# Altium schematic sheet anti-phubber.SchDoc
size A4
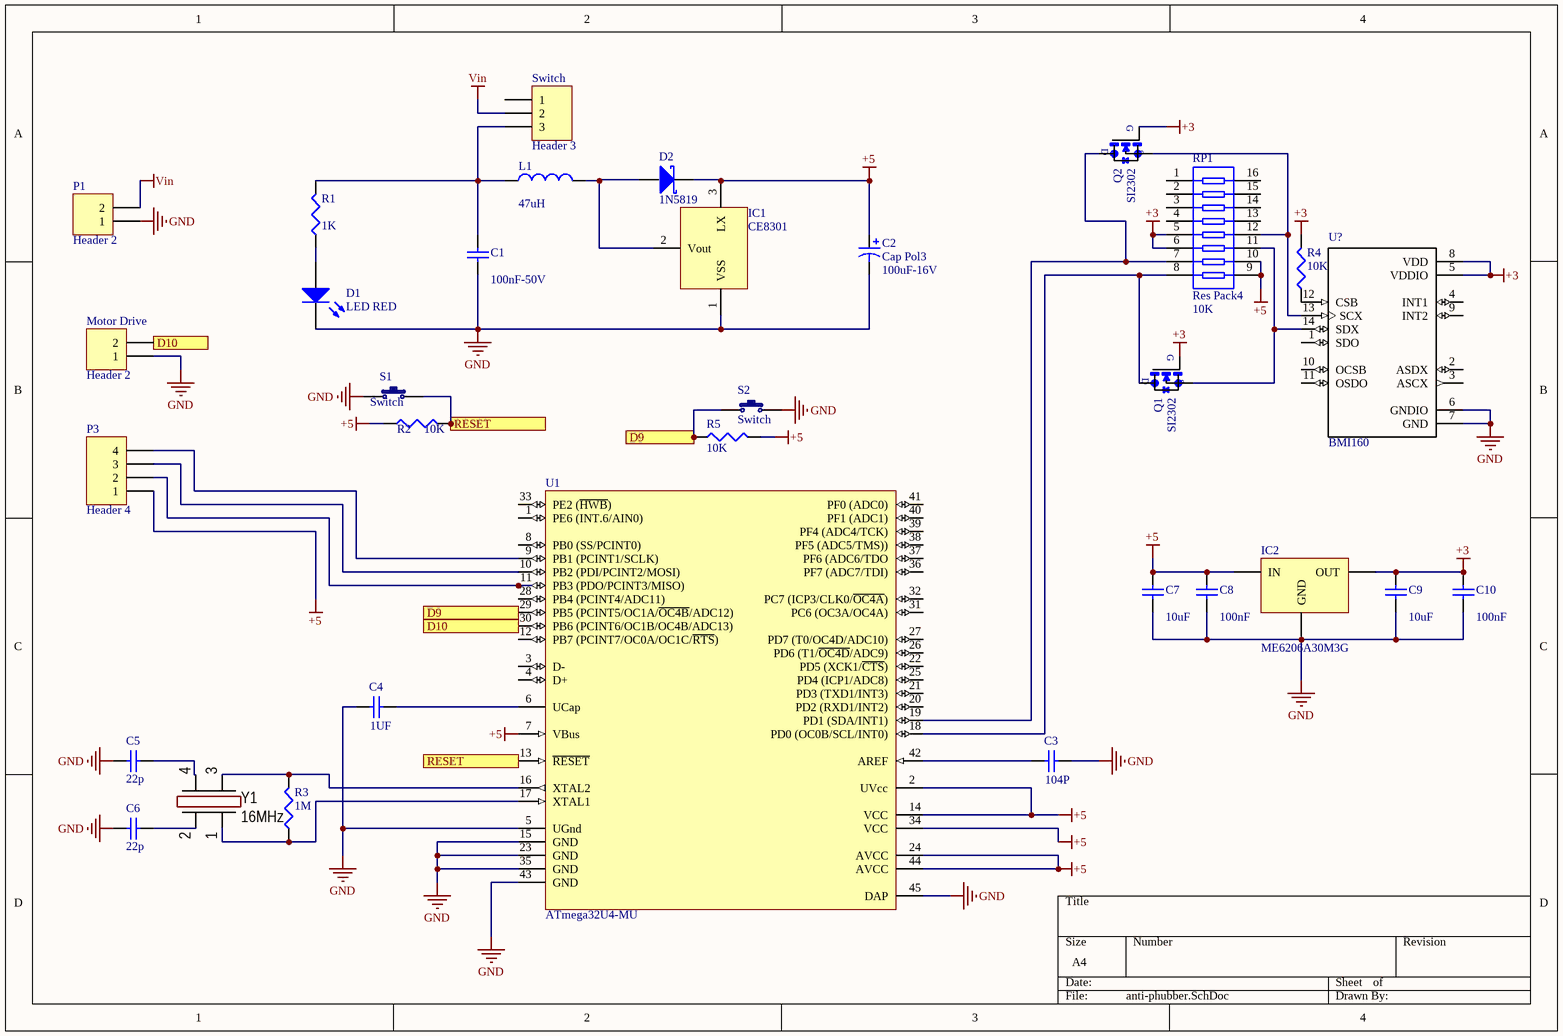
[diagram p0: anti-phubber.SchDoc]

## Parts
C1  value 100nF-50V  [C1206]  (hidden comment: Cap Semi)
C2  Cap Pol3  value 100uF-16V  [1812]
C3  value 104P  [C1206]  (hidden comment: Cap Semi)
C4  value 1UF  [C1206]  (hidden comment: Cap Semi)
C5  value 22p  [C1206]  (hidden comment: Cap Semi)
C6  value 22p  [C1206]  (hidden comment: Cap Semi)
C7  value 10uF  [C1206]  (hidden comment: Cap Semi)
C8  value 100nF  [C1206]  (hidden comment: Cap Semi)
C9  value 10uF  [C1206]  (hidden comment: Cap Semi)
C10  value 100nF  [C1206]  (hidden comment: Cap Semi)
D1  LED RED  [3.2X1.6X1.1]
D2  1N5819  [DO-214AC]
IC1  CE8301  [SOT-89]
IC2  ME6206A30M3G  [SOT-223]
L1  value 47uH  [0402-A]  (hidden comment: Inductor)
Motor_Drive  Header 2  [HDR1X2]
P1  Header 2  [HDR1X2]
P3  Header 4  [HDR1X4]
Q1  SI2302  [*SOT23]
Q2  SI2302  [*SOT23]
R1  value 1K  [J1-0603]
R2  value 10K  [J1-0603]  (hidden comment: Res3)
R3  value 1M  [J1-0603]  (hidden comment: Res3)
R4  value 10K  [J1-0603]  (hidden comment: Res3)
R5  value 10K  [J1-0603]  (hidden comment: Res3)
RP1  Res Pack4  value 10K  [SSOP16_N]
S1  Switch  [TD-19XA]
S2  Switch  [Switch1]
Switch  Header 3  [HDR1X3]
U1  ATmega32U4-MU  [44PW_N]
U?  BMI160  [*PQFN50P300X250X88-14N]
Y1  Frequency: 16MHz  [OSC: 2520]

## Ports
D9, D10, RESET

## Nets
+3: C9.2 C10.2 IC2.2(OUT) Q1.1(G) Q2.1(G) R4.2 RP1.5 RP1.6 U?.5(VDDIO) U?.8(VDD)
+5: C2.1 C7.2 C8.2 D2.2(K) IC1.3(LX) IC2.3(IN) P3.1 R2.1 R5.1 RP1.9 RP1.10 U1.2(UVcc) U1.7(VBus) U1.14(VCC) U1.24(AVCC) U1.34(VCC) U1.44(AVCC)
GND: C1.1 C2.2 C3.2 C4.1 C5.2 C6.2 C7.1 C8.1 C9.1 C10.1 D1.2(K) IC1.1(VSS) IC2.1(GND) Motor_Drive.1 P1.1 S1.1 S2.1 U1.5(UGnd) U1.15(GND) U1.23(GND) U1.35(GND) U1.43(GND) U1.45(DAP) U?.6(GNDIO) U?.7(GND)
Vin: P1.2 Switch.2
D9: R5.2 S2.2 U1.29(PB5_(PCINT5/OC1A/~{OC4B}/ADC12)) ; port D9
D10: Motor_Drive.2 U1.30(PB6_(PCINT6/OC1B/OC4B/ADC13)) ; port D10
RESET: R2.2 S1.2 U1.13(~{RESET}) ; port RESET
NetC1_2: C1.2 L1.1 R1.2 Switch.3
NetC3_1: C3.1 U1.42(AREF)
NetC4_2: C4.2 U1.6(UCap)
NetC5_1: C5.1 Y1.4
NetC6_1: C6.1 Y1.2
NetD1_1: D1.1(A) R1.1
NetD2_1: D2.1(A) IC1.2(Vout) L1.2
NetP3_2: P3.2 U1.11(PB3_(PDO/PCINT3/MISO))
NetP3_3: P3.3 U1.10(PB2_(PDI/PCINT2/MOSI))
NetP3_4: P3.4 U1.9(PB1_(PCINT1/SCLK))
NetQ1_2: Q1.2(S) RP1.11 U?.14(SDX)
NetQ1_3: Q1.3(D) RP1.8 U1.18(PD0_(OC0B/SCL/INT0))
NetQ2_2: Q2.2(S) RP1.12 U?.13(SCX)
NetQ2_3: Q2.3(D) RP1.7 U1.19(PD1_(SDA/INT1))
NetR3_1: R3.1 U1.17(XTAL1) Y1.1
NetR3_2: R3.2 U1.16(XTAL2) Y1.3
NetR4_1: R4.1 U?.12(CSB)

Not connected (* = marked no-connect by the designer): RP1 1 2 3 4 13 14 15 16; Switch 1; U1 1(PE6_(INT.6/AIN0)) 3(D-) 4(D+) 8(PB0_(SS/PCINT0)) 12(PB7_(PCINT7/OC0A/OC1C/~{RTS})) 20(PD2_(RXD1/INT2)) 21(PD3_(TXD1/INT3)) 22(PD5_(XCK1/~{CTS})) 25(PD4_(ICP1/ADC8)) 26(PD6_(T1/~{OC4D}/ADC9)) 27(PD7_(T0/OC4D/ADC10)) 28(PB4_(PCINT4/ADC11)) 31(PC6_(OC3A/OC4A)) 32(PC7_(ICP3/CLK0/~{OC4A})) 33(PE2_(~{HWB})) 36(PF7_(ADC7/TDI)) 37(PF6_(ADC6/TDO) 38(PF5_(ADC5/TMS))) 39(PF4_(ADC4/TCK)) 40(PF1_(ADC1)) 41(PF0_(ADC0)); U? 1(SDO) 2(ASDX) 3(ASCX) 4(INT1) 9(INT2) 10(OCSB) 11(OSDO)

## Library data of the parts
C1 C3-C10 = Cap Semi: Capacitor (Semiconductor SIM Model); Published: 8-Jun-2000; LatestRevisionDate: 29-May-2009; LatestRevisionNote: IPC-7351 Footprint Added.; PackageReference: C1206; Publisher: Altium Limited; PackageDescription: Chip Capacitor
C2 = Cap Pol3: Polarized Capacitor (Surface Mount); Published: 8-Jun-2000; LatestRevisionDate: 29-May-2009; LatestRevisionNote: IPC-7351 Footprint Added.; PackageReference: C0805; Publisher: Altium Limited; PackageDescription: Chip Capacitor
D1 = LED2: Typical RED, GREEN, YELLOW, AMBER GaAs LED; Published: 8-Jun-2000; LatestRevisionDate: 17-Jul-2002; LatestRevisionNote: Re-released for DXP Platform.; PackageVersion: Feb-2002; PackageReference: 3.2X1.6X1.1; Publisher: Altium Limited; PackageDescription: SM LED; 2 Flat Leads
D2 = Diode Schottky
IC2 = ASM1117
L1 = Inductor: Code_IEC: 1005; Published: 8-Jun-2000; LatestRevisionDate: 29-May-2009; LatestRevisionNote: IPC-7351 Footprint Added.; PackageReference: 0402-A; Publisher: Altium Limited; PackageDescription: Chip Inductor; Code_JEITA: 0402
Motor_Drive P1 = Header 2: Header, 2-Pin; LatestRevisionDate: 17-Jul-2002; LatestRevisionNote: Re-released for DXP Platform.; Publisher: Altium Limited
P3 = Header 4: Header, 4-Pin; LatestRevisionDate: 17-Jul-2002; LatestRevisionNote: Re-released for DXP Platform.; Publisher: Altium Limited
Q1 Q2 = SI2302: MF: Vishay Siliconix; Price: None; Package: SOT-23-3 Vishay Siliconix; MP: SI2302; SnapEDA_Link: https://www.snapeda.com/parts/SI2302/Vishay%20Siliconix/view-part/?ref=snap; Availability: Unavailable; Value: *
R1-R5 = Res3: Resistor; Published: 8-Jun-2000; LatestRevisionDate: 29-May-2009; LatestRevisionNote: IPC-7351 Footprint Added.; PackageReference: J1-0603; Publisher: Altium Limited; PackageDescription: Chip Resistor
RP1 = Res Pack4: Isolated Resistor Network; Published: 24-Mar-1999; LatestRevisionDate: 29-May-2009; LatestRevisionNote: IPC-7351 Footprint Added.; PackageVersion: Oct-2003; PackageReference: SSOP16; Publisher: Altium Limited; PackageDescription: 16-Pin Plastic Small Outline Package 0.65 mm Pitch; Code_JEDEC: MO-150-AC; Code_IPC: SOP65P780-16
Switch = Header 3: Header, 3-Pin; LatestRevisionDate: 17-Jul-2002; LatestRevisionNote: Re-released for DXP Platform.; Publisher: Altium Limited
U1 = ATmega32U4-MU: 8-bit AVR Microcontroller, 2.7-5.5V, 16MHz, 32KB Flash, 1KB EEPROM, 2.5KB SRAM, USB Controller, 44-pin QFN, Industrial Grade (-40°C to 85°C), Ext Osc; DatasheetVersion: revF, Nov-2010; PackageVersion: revG, Sep-2009; PackageReference: 44PW; PackageDescription: 44-Pin Quad Flat No-Lead Package, 7 x 7 mm Body, 0.5 mm Pitch (QFN); Code_JEDEC: MO-220-VKKD-1; ComponentLink1Description: Manufacturer URL; ComponentLink1URL: http://www.atmel.com/; ComponentLink2Description: ATmega16U4/32U4 Datasheet; ComponentLink2URL: http://www.atmel.com/dyn/resources/prod_documents/doc7766.pdf; ComponentLink3Description: ATmega16U4 ATmega32U4 Summary; ComponentLink3URL: http://www.atmel.com/dyn/resources/prod_documents/7766S.pdf
U? = BMI160: BMI160 2.5 x 3 mm Tiaxial Accelerometer / Gyroscope Inertial Measurement Unit; MF: Bosch; Availability: Unavailable; SnapEDA_Link: https://www.snapeda.com/parts/BMI160/Bosch%20Sensortec/view-part/?ref=snap; Price: None; Package: LGA-14 Bosch; MP: BMI160; Value: *
Y1 = Crystal_2520: Manufacturer: Epson; PartNumber: FA-20H 16.0000MF20X-B; ValueManufacturerPartNumber: Crystal, 16MHz, 16pF, ±20ppm, case 2520, -40...+85°C; LoadCapacitance: 16pF; Tolerance: ±20ppm; Package: case 2520; HelpURL: https://www.digikey.com/product-detail/en/epson/FA-20H-16.0000MF20X-B/SER4202-ND/7430937; Temperature: -40...+85°C; TypeOscilator: Crystal